# EAGLE design Nikon_PowerBoardV2 (EAGLE 7.3.0)
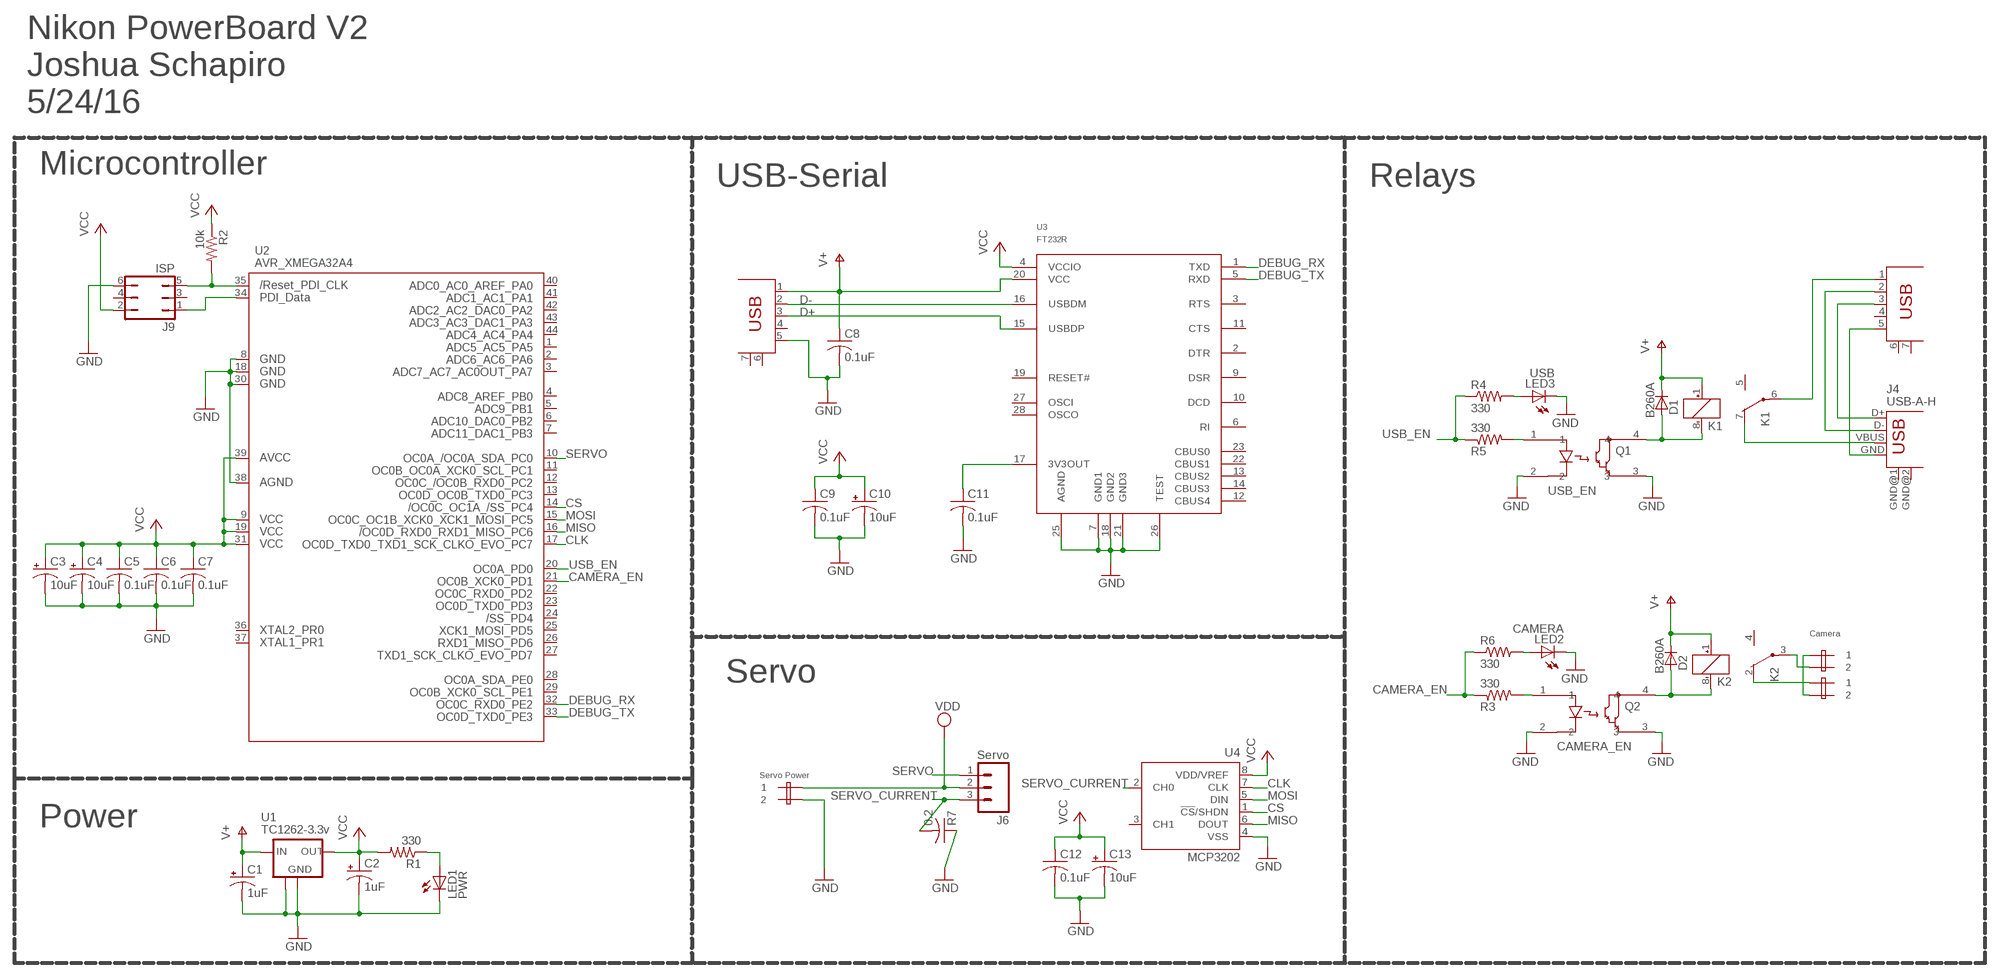
[diagram p0: schematic, sheet 1]

## Parts
C1  1uF  CAP_POL1206  [EIA3216]
C2  1uF  CAP_POL1206  [EIA3216]
C3  10uF  CAP_POL1206  [EIA3216]
C4  10uF  CAP_POL1206  [EIA3216]
C5  0.1uF  C-USC0603  [C0603]
C6  0.1uF  C-USC0603  [C0603]
C7  0.1uF  C-USC0603  [C0603]
C8  0.1uF  C-USC0603  [C0603]
C9  0.1uF  C-USC0603  [C0603]
C10  10uF  CAP_POL1206  [EIA3216]
C11  0.1uF  C-USC0603  [C0603]
C12  0.1uF  C-USC0603  [C0603]
C13  10uF  CAP_POL1206  [EIA3216]
D1  B260A  DIODESMA  [SMA-DIODE]
D2  B260A  DIODESMA  [SMA-DIODE]
J1  Camera  2-PIN_SCREWTERMINAL  [2-PIN_SCREWTERM]
J2  Camera  2-PIN_SCREWTERMINAL  [2-PIN_SCREWTERM]
J4  USB-A-H  [USB-A-H]
J5  SERVO  2-PIN_SCREWTERMINAL  [2-PIN_SCREWTERM]
J6  Servo  M03LONGPADS  [1X03_LONGPADS]
J7  MICRO-USB  MICRO-USBTO_SUPPORT  [MICRO_USB_SM_W/_TO_PINS]
J8  MICRO-USB  MICRO-USBTO_SUPPORT  [MICRO_USB_SM_W/_TO_PINS]
J9  ISP  JP3Q  [JP3Q]
K1  USB_EN  G6K-2F  [G6K-2F]
K2  CAMERA_EN  G6K-2F  [G6K-2F]
LED1  PWR  LEDCHIPLED_0603  [CHIPLED_0603]
LED2  CAMERA  LEDCHIPLED_0603  [CHIPLED_0603]
LED3  USB  LEDCHIPLED_0603  [CHIPLED_0603]
Q1  USB_EN  OPTOISOLATOR_SINGLE  [4-PIN_MINI-FLAT]
Q2  CAMERA_EN  OPTOISOLATOR_SINGLE  [4-PIN_MINI-FLAT]
R1  330  R-US_R0603  [R0603]
R2  10k  R-US_R0603  [R0603]
R3  330  R-US_R0603  [R0603]
R4  330  R-US_R0603  [R0603]
R5  330  R-US_R0603  [R0603]
R6  330  R-US_R0603  [R0603]
R7  0.2  C-USC1206  [C1206]
U1  TC1262-3.3v  REGULATOR  [SOT223]
U2  AVR_XMEGA32A4  AVR_XMEGA_A4_44A  [TQFP44]
U3  FT232R  [SSOP28]
U4  MCP3202  MCP3202SN  [SO-08]

## Nets
CAMERA_EN: R3.1 R6.1 U2.21(PD1)
CLK: U2.17(PC7) U4.7(CLK)
CS: U2.14(PC4) U4.1(!CS!/SHDN)
D+: J8.3(D+) U3.15(USBDP)
D-: J8.2(D-) U3.16(USBDM)
DEBUG_RX: U2.32(PE2) U3.1(TXD)
DEBUG_TX: U2.33(PE3) U3.5(RXD)
GND: C1.C(-) C2.C(-) C3.C(-) C4.C(-) C5.2 C6.2 C7.2 C8.2 C9.2 C10.C(-) C11.2 C12.2 C13.C(-) J5.P$2 J8.5(GND) J9.6 LED1.C LED2.C LED3.C Q1.2 Q1.3 Q2.2 Q2.3 R7.1 U1.2(GND) U1.4(GND1) U2.8(GND1) U2.18(GND2) U2.30(GND3) U2.38(AGND) U3.7(GND1) U3.18(GND2) U3.21(GND3) U3.25(AGND) U3.26(TEST) U4.4(VSS)
MISO: U2.16(PC6) U4.6(DOUT)
MOSI: U2.15(PC5) U4.5(DIN)
N$1: J9.1 U2.34(PDI_DATA)
N$2: J4.GND J7.5(GND)
N$3: J2.P$2 K2.3(2:P)
N$4: LED1.A R1.1
N$5: Q1.1 R5.2
N$6: J9.5 R2.2 U2.35(RESET)
N$7: D2.A K2.8(1:-) Q2.4
N$8: J7.1(VBUS) K1.6(3:P)
N$9: J4.VBUS K1.7(3:O)
N$10: LED3.A R4.2
N$11: Q2.1 R3.2
N$12: J1.P$1 K2.2(2:O)
N$13: J1.P$2 J2.P$1
N$18: C11.1 U3.17(3V3OUT)
N$19: LED2.A R6.2
N$90: J4.D+ J7.3(D+)
N$100: J4.D- J7.2(D-)
N$180: D1.A K1.8(1:-) Q1.4
SERVO: J6.1 U2.10(PC0)
SERVO_CURRENT: J6.3 R7.2 U4.2(CH0)
USB_EN: R4.1 R5.1 U2.20(PD0)
V+: C1.A(+) C8.1 D1.C D2.C J8.1(VBUS) K1.1(1:+) K2.1(1:+) U1.1(IN) U3.20(VCC)
VCC: C2.A(+) C3.A(+) C4.A(+) C5.1 C6.1 C7.1 C9.1 C10.A(+) C12.1 C13.A(+) J9.2 R1.2 R2.1 U1.3(OUT) U2.9(VCC1) U2.19(VCC2) U2.31(VCC3) U2.39(AVCC) U3.4(VCCIO) U4.8(VDD/VREF)
VDD: J5.P$1 J6.2
Unconnected: J4.GND@1(GND) J4.GND@2(GND) J7.4(ID) J7.6(MTN3) J7.7(MTN4) J8.4(ID) J8.6(MTN3) J8.7(MTN4) J9.3 J9.4 K1.2(2:O) K1.3(2:P) K1.4(2:S) K1.5(3:S) K2.4(2:S) K2.5(3:S) K2.6(3:P) K2.7(3:O) U2.1(PA5) U2.2(PA6) U2.3(PA7) U2.4(PB0) U2.5(PB1) U2.6(PB2) U2.7(PB3) U2.11(PC1) U2.12(PC2) U2.13(PC3) U2.22(PD2) U2.23(PD3) U2.24(PD4) U2.25(PD5) U2.26(PD6) U2.27(PD7) U2.28(PE0) U2.29(PE1) U2.36(PR0) U2.37(PR1) U2.40(PA0) U2.41(PA1) U2.42(PA2) U2.43(PA3) U2.44(PA4) U3.2(DTR) U3.3(RTS) U3.6(RI) U3.9(DSR) U3.10(DCD) U3.11(CTS) U3.12(CBUS4) U3.13(CBUS2) U3.14(CBUS3) U3.19(RESET#) U3.22(CBUS1) U3.23(CBUS0) U3.27(OSCI) U3.28(OSCO) U4.3(CH1)

## Notes on the sheet
- Nikon PowerBoard V2
  Joshua Schapiro
  5/24/16
- Microcontroller
- USB-Serial | Relays
- Camera
- Servo
- Servo Power
- Power

## Library data of the parts
C1-C4 C10 C13 = SparkFun:CAP_POL: Capacitor Polarized These are standard SMD and PTH capacitors. Normally 10uF, 47uF, and 100uF in electrolytic and tantalum varieties. Always verify the external diameter of the through hole cap, it varies with capacity, voltage, and manufacturer. The EIA devices should be standard.
C5 R7 = rcl:C-US: CAPACITOR, American symbol
C6-C9 C11 C12 = resistor:C-US: CAPACITOR, American symbol
D1 D2 = SparkFun:DIODE: Diode These are standard reverse protection diodes and small signal diodes. SMA package can handle up to about 1A. SOD-323 can handle about 200mA. What the SOD-323 package when ordering, there are some mfgs out there that are 5-pin packages.
J1 J2 J5 = Josh:2-PIN_SCREWTERMINAL
J4 = GadgetOne:USB: USB Connectors
J6 = SparkFun:M03: Header 3 Standard 3-pin 0.1" header. Use with straight break away headers (SKU : PRT-00116), right angle break away headers (PRT-00553), swiss pins (PRT-00743), machine pins (PRT-00117), and female headers (PRT-00115). Molex polarized connector foot print use with SKU : PRT-08232 with associated crimp pins and housings.
J7 J8 = Josh:MICRO-USB
J9 = jumper:JP3Q: JUMPER
K1 K2 = relay:G6K: Low Signal Relay oeiwcsnts1.omron.com/.. D20G6K0100.pdf
LED1-LED3 = led:LED: LED OSRAM: - CHIPLED LG R971, LG N971, LY N971, LG Q971, LY Q971, LO R971, LY R971 LH N974, LH R974 LS Q976, LO Q976, LY Q976 LO Q996 - Hyper CHIPLED LW Q18S LB Q993, LB Q99A, LB R99A - SideLED LS A670, LO A670, LY A670, LG A670, LP A670 LB A673, LV A673, LT A673, LW A673 LH A674 LY A675 LS A676, LA A676, LO A676, LY A676, LW A676 LS A679, LY A679, LG A679 - Hyper Micro SIDELED® LS Y876, LA Y876, LO Y876, LY Y876 LT Y87S - SmartLED LW L88C, LW L88S LB L89C, LB L89S, LG L890 LS L89K, LO L89K, LY L89K LS L896, LA L896, LO L896, LY L896 - TOPLED LS T670, LO T670, LY T670, LG T670, LP T670 LSG T670, LSP T670, LSY T670, LOP T670, LYG T670 LG T671, LOG T671, LSG T671 LB T673, LV T673, LT T673, LW T673 LH T674 LS T676, LA T676, LO T676, LY T676, LB T676, LH T676, LSB T676, LW T676 LB T67C, LV T67C, LT T67C, LS T67K, LO T67K, LY T67K, LW E67C LS E67B, LA E67B, LO E67B, LY E67B, LB E67C, LV E67C, LT E67C LW T67C LS T679, LY T679, LG T679 LS T770, LO T770, LY T770, LG T770, LP T770 LB T773, LV T773, LT T773, LW T773 LH T774 LS E675, LA E675, LY E675, LS T675 LS T776, LA T776, LO T776, LY T776, LB T776 LHGB T686 LT T68C, LB T68C - Hyper Mini TOPLED® LB M676 - Mini TOPLED Santana® LG M470 LS M47K, LO M47K, LY M47K Source: http://www.osram.convergy.de LUXEON: - LUMILED® LXK2-PW12-R00, LXK2-PW12-S00, LXK2-PW14-U00, LXK2-PW14-V00 LXK2-PM12-R00, LXK2-PM12-S00, LXK2-PM14-U00 LXK2-PE12-Q00, LXK2-PE12-R00, LXK2-PE12-S00, LXK2-PE14-T00, LXK2-PE14-U00 LXK2-PB12-K00, LXK2-PB12-L00, LXK2-PB12-M00, LXK2-PB14-N00, LXK2-PB14-P00, LXK2-PB14-Q00 LXK2-PR12-L00, LXK2-PR12-M00, LXK2-PR14-Q00, LXK2-PR14-R00 LXK2-PD12-Q00, LXK2-PD12-R00, LXK2-PD12-S00 LXK2-PH12-R00, LXK2-PH12-S00 LXK2-PL12-P00, LXK2-PL12-Q00, LXK2-PL12-R00 Source: www.luxeon.com KINGBRIGHT: KA-3528ASYC Source: www.kingbright.com
Q1 Q2 = Josh:OPTOISOLATOR_SINGLE: Digikey: 425-2098-1-ND If = 10ma Ic = 80ma
R1-R6 = resistor:R-US_: RESISTOR, American symbol
U1 = GadgetOne:REGULATOR: VOLTAGE REGULATOR, see: http://focus.ti.com/lit/ds/symlink/ua78m05.pdf
U2 = xmega:AVR_XMEGA_A4_: Device for Atmel AVR XMEGA A4 Series
U3 = gadgetry:FT232R
U4 = microchip:MCP3202: 2.7V Dual Channel 12-Bit A/D Converter with SPI Serial Interface Source: http://ww1.microchip.com/downloads/en/DeviceDoc/21034D.pdf

## Net classes
4 xxwide: width 0.203 mm

## Board
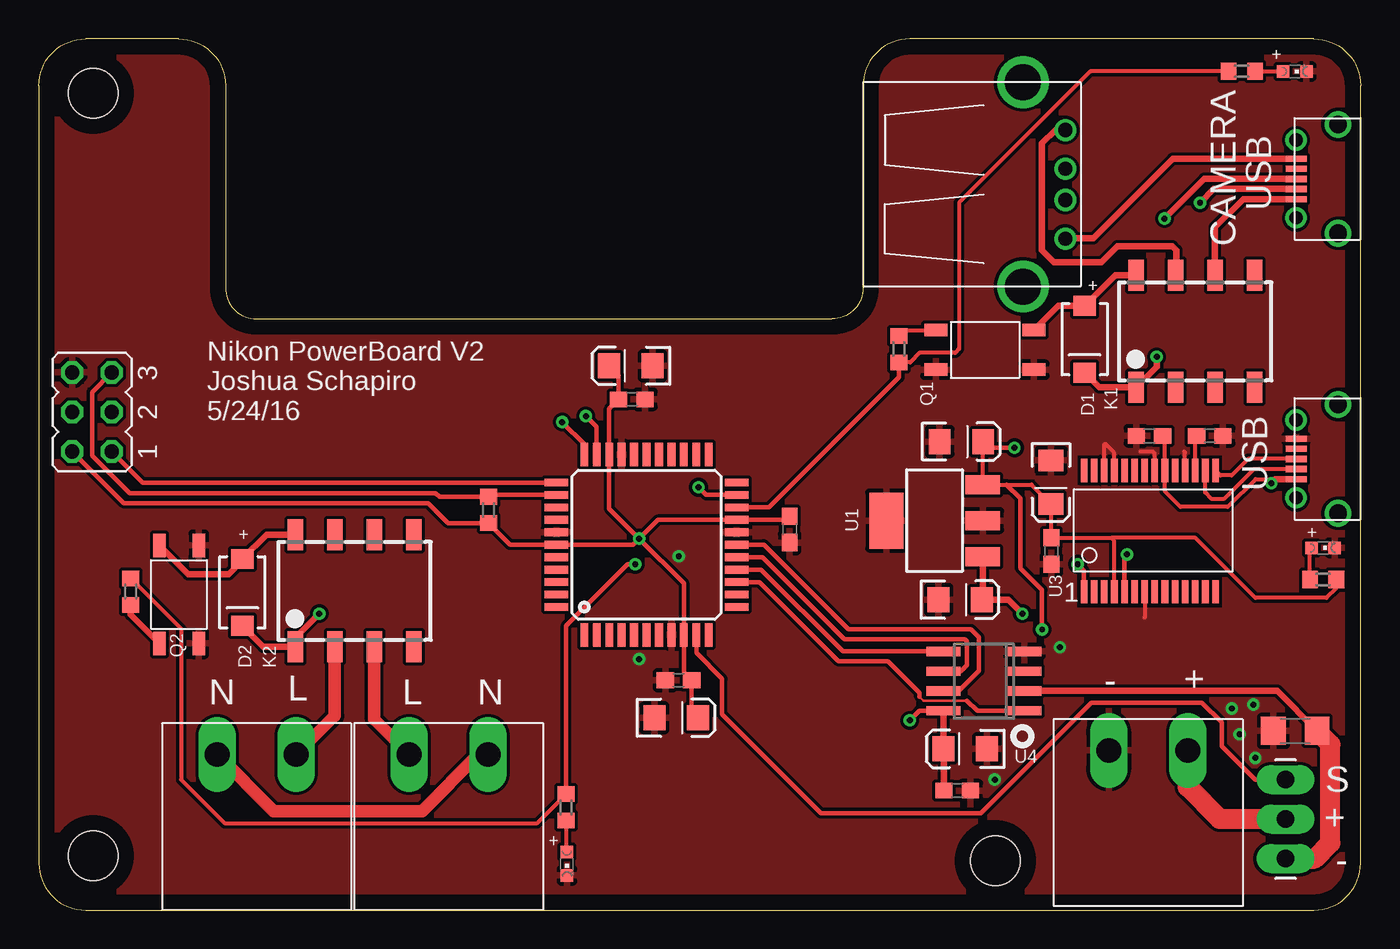
[diagram p1: board, top side]
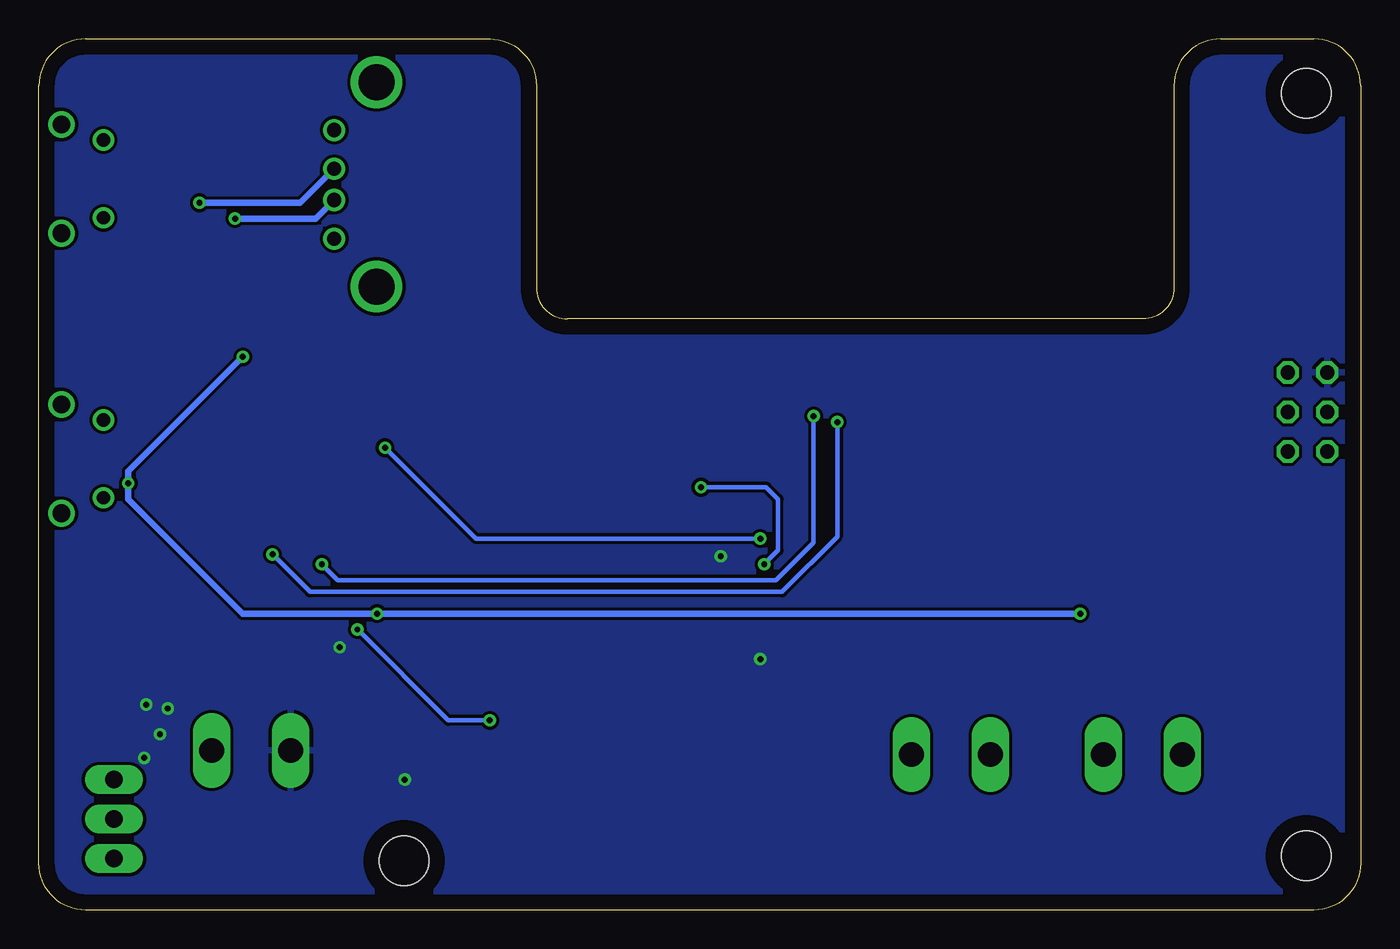
[diagram p2: board, bottom side, seen from below]

Size 85 x 56 mm. Coordinates in mm from the lower left corner, seen from the top.
Outline: 3,0 82,0 arc90 85,3 85,53 arc90 82,56 56,56 arc90 53,53 53,40 arc-90 51,38 14,38 arc-90 12,40 12,53 arc90 9,56 3,56 arc90 0,53 0,3 arc90 3,0
Copper layers (1*16): Top 0.035mm / dielectric 1.5mm / Bottom 0.035mm
Design rules "default *": minimum track width 6mil, minimum drill 15mil, track to track 8mil, track to pad 8mil, pad to pad 8mil, via to via 8mil, smd to smd 8mil, copper to edge 40mil, drill to drill 8mil, minimum pad ring 10mil, minimum via ring 8mil, stop-mask expansion 4mil, vias tented up to drill 0mil, thermal gap 10mil
Holes 3.17 mm at 3.5,52.5 61.5,3.17 3.5,3.5
tRestrict: area 66.8,19.5 to 76.1,21.4; area 66.8,27.3 to 76.1,29.2

### Footprints (pad centres in the part's own frame; a part is rotated, then mirrored left to right if it is on the bottom)
EIA3216 = smd 1.4 x 1.6: A 1.4,0; C -1.4,0
C0603 = smd 1.1 x 1: 1 -0.85,0; 2 0.85,0
SMA-DIODE = smd 1.27 x 1.47: A -2.15,0; C 2.15,0
2-PIN_SCREWTERM = drill 1.6 long: P$1 -2.54,0; P$2 2.54,0
USB-A-H = drill 0.914: D+ 2.718,-1.003; D- 2.718,1.003; GND 2.718,-3.493; VBUS 2.718,3.493 | drill 2.311: GND@1 0,6.566; GND@2 0,-6.566
1X03_LONGPADS = drill 1.118 pad 1.88 long: 1 0,0; 2 2.54,0; 3 5.08,0
MICRO_USB_SM_W/_TO_PINS = smd 0.4 x 1.35: 1 -1.3,4.15; 2 -0.65,4.15; 3 0,4.15; 4 0.65,4.15; 5 1.3,4.15 | drill 1.15: 6 -3.5,1.45; 7 3.5,1.45 | drill 0.85: P$1 -2.5,4.15; P$2 2.5,4.15
JP3Q = drill 0.914 octagon: 1 -2.54,-1.27; 2 -2.54,1.27; 3 0,-1.27; 4 0,1.27; 5 2.54,-1.27; 6 2.54,1.27
G6K-2F = smd 1 x 2: 1 -3.81,-3.6; 2 -1.27,-3.6; 3 1.27,-3.6; 4 3.81,-3.6; 5 3.81,3.6; 6 1.27,3.6; 7 -1.27,3.6; 8 -3.81,3.6
CHIPLED_0603 = smd 0.8 x 0.8: A 0,-0.75; C 0,0.75
4-PIN_MINI-FLAT = smd 1.5 x 0.8: 1 -3.15,1.27; 2 -3.15,-1.27; 3 3.15,-1.27; 4 3.15,1.27
R0603 = smd 1 x 1.1: 1 -0.85,0; 2 0.85,0
C1206 = smd 1.6 x 1.8: 1 -1.4,0; 2 1.4,0
SOT223 = smd 1.219 x 2.235: 1 -2.311,-3.099; 2 0,-3.099; 3 2.311,-3.099 | smd 3.6 x 2.2: 4 0,3.099
TQFP44 = smd 1.5 x 0.5: 1 -5.8,4; 2 -5.8,3.2; 3 -5.8,2.4; 4 -5.8,1.6; 5 -5.8,0.8; 6 -5.8,0; 7 -5.8,-0.8; 8 -5.8,-1.6; 9 -5.8,-2.4; 10 -5.8,-3.2; 11 -5.8,-4; 23 5.8,-4; 24 5.8,-3.2; 25 5.8,-2.4; 26 5.8,-1.6; 27 5.8,-0.8; 28 5.8,0; 29 5.8,0.8; 30 5.8,1.6; 31 5.8,2.4; 32 5.8,3.2; 33 5.8,4 | smd 0.5 x 1.5: 12 -4,-5.8; 13 -3.2,-5.8; 14 -2.4,-5.8; 15 -1.6,-5.8; 16 -0.8,-5.8; 17 0,-5.8; 18 0.8,-5.8; 19 1.6,-5.8; 20 2.4,-5.8; 21 3.2,-5.8; 22 4,-5.8; 34 4,5.8; 35 3.2,5.8; 36 2.4,5.8; 37 1.6,5.8; 38 0.8,5.8; 39 0,5.8; 40 -0.8,5.8; 41 -1.6,5.8; 42 -2.4,5.8; 43 -3.2,5.8; 44 -4,5.8
SSOP28 = smd 0.425 x 1.5: 1 0.65,-1.3; 2 1.3,-1.3; 3 1.95,-1.3; 4 2.6,-1.3; 5 3.25,-1.3; 6 3.9,-1.3; 7 4.55,-1.3; 8 5.2,-1.3; 9 5.85,-1.3; 10 6.5,-1.3; 11 7.15,-1.3; 12 7.8,-1.3; 13 8.45,-1.3; 14 9.1,-1.3; 15 9.1,6.5; 16 8.45,6.5; 17 7.8,6.5; 18 7.15,6.5; 19 6.5,6.5; 20 5.85,6.5; 21 5.2,6.5; 22 4.55,6.5; 23 3.9,6.5; 24 3.25,6.5; 25 2.6,6.5; 26 1.95,6.5; 27 1.3,6.5; 28 0.65,6.5
SO-08 = smd 0.6 x 2.2: 1 -1.905,-2.6; 2 -0.635,-2.6; 3 0.635,-2.6; 4 1.905,-2.6; 5 1.905,2.6; 6 0.635,2.6; 7 -0.635,2.6; 8 -1.905,2.6

### Placement (x,y rotation side)
C1  59.25,19.95 0 top
C2  59.33,30.11 0 top
C3  40.98,12.36 0 top
C4  38.06,34.99 180 top
C5  48.27,24.47 270 top
C6  38.14,32.83 0 top
C7  41.14,14.77 180 top
C8  71.42,30.48 180 top
C9  65.11,23.07 270 top
C10  65.09,27.5 270 top
C11  75.3,30.48 0 top
C12  59.05,7.68 0 top
C13  59.56,10.36 180 top
D1  67.25,36.69 270 top
D2  13.09,20.42 270 top
J1  14,10 180 top
J2  26.35,10 180 top
J4  63.29,46.65 0 top
J5  71.34,10.25 180 top
J6  80.17,8.39 270 top
J7  85,47 90 top
J8  85,29 90 top
J9  3.42,32.01 90 top
K1  74.37,37.2 0 top
K2  20.3,20.52 0 top
LED1  82.58,23.28 270 top
LED2  33.96,2.97 180 top
LED3  80.76,53.9 270 top
Q1  60.84,36.01 0 top
Q2  9.01,20.29 90 top
R1  82.58,21.25 0 top
R2  28.92,25.71 90 top
R3  5.91,20.46 270 top
R4  77.35,53.92 0 top
R5  55.32,36.06 90 top
R6  33.91,6.6 270 top
R7  80.79,11.52 0 top
U1  57.6,25.03 90 top
U2  39.08,23.48 90 top
U3  66.56,21.76 0 top
U4  60.77,14.71 90 top

### Tracks (layer width: path | path; a pad name or v marks a point on that pad's centre or on a via)
CAMERA_EN  (via drill 0.38)
  Top 0.254: R3.1 9.14,18.08 9.14,8.38 11.94,5.59 32.04,5.59 R6.1
  Top 0.305: R6.1 33.91,18.28 37.85,22.23 v38.35,22.23 | v42.42,27.18 42.91,26.68 U2.21
  Bottom 0.305: v38.35,22.23 37.47,23.11 37.47,26.42 38.23,27.18 v42.42,27.18
CLK
  Top 0.305: U2.17 46.62,23.48 52.07,18.03 59.94,18.03 60.45,17.53 60.45,15.37 59.16,14.08 U4.7
CS
  Top 0.152: 59.69,13.46 56.9,13.46 56.64,13.72
  Top 0.305: U4.1 60.34,12.81 59.69,13.46 | 56.64,13.72 56.64,13.97 54.61,16 51.44,16 46.36,21.08 U2.14
D+
  Top 0.254: J8.3 77.77,29 76.71,27.94 75.98,27.94 U3.15
D-
  Top 0.254: J8.2 78.13,28.35 76.2,26.42 75.44,26.42 75.01,26.84 U3.16
DEBUG_RX  (via drill 0.38)
  Top 0.305: U2.32 35.88,31.05 v35.18,31.75 | v66.8,22.23 67.21,21.82 U3.1
  Bottom 0.305: v35.18,31.75 35.18,23.62 37.59,21.21 65.79,21.21 v66.8,22.23
DEBUG_TX  (via drill 0.38)
  Top 0.305: U2.33 35.08,29.95 v33.66,31.37 | v69.98,22.86 69.81,22.69 U3.5
  Bottom 0.305: v33.66,31.37 33.66,24 37.21,20.45 67.56,20.45 v69.98,22.86
GND  (via drill 0.38)
  Top 0.254: U3.21 71.76,29.33 71.63,29.46 70.87,29.46 | U3.18 73.71,29.41 73.66,29.46 | U3.26 68.51,29.9 68.58,29.97 69.16,29.39 U3.25 | U3.7 71.11,18.81 71.12,18.8
  other vias: 61.47,8.38 65.66,16.89 76.71,12.95 78.11,13.21 77.22,11.3 78.23,9.78 38.61,16.13 41.15,22.73
  pour Bottom: 0,0 85,0 85,56 0,56
  pour Top: 0,56 85,56 85,0 0,0
MISO
  Top 0.305: U4.6 59.29,15.35 59.69,15.75 59.69,17.27 59.56,17.4 51.82,17.4 46.53,22.68 U2.16
MOSI
  Top 0.305: U4.5 51.71,16.62 46.45,21.88 U2.15
N$1
  Top 0.305: U2.34 6.68,27.48 J9.1
N$2
  Top 0.406: J7.5 72.94,48.3 67.82,43.18 66.03,43.18 J4.GND
N$3
  Top 0.813: J2.P$2 21.57,12.25 K2.3
N$4
  Top 0.254: R1.1 81.73,23.18 LED1.A
N$5
  Top 0.254: R5.2 55.69,37.28 Q1.1
N$6
  Top 0.305: J9.5 3.43,33.29 3.43,29.21 5.84,26.8 25.53,26.8 25.76,26.56 R2.2 29.03,26.68 U2.35
N$7
  Top 0.406: K2.8 14.63,24.12 D2.A 13.09,22.48 12.19,21.59 9.59,21.59 Q2.4
N$8
  Top 0.406: J7.1 77.45,45.7 75.64,43.89 K1.6
N$9
  Top 0.406: K1.7 73.15,40.86 73.15,42.42 72.9,42.67 69.34,42.67 68.33,41.66 65.28,41.66 64.52,42.42 64.52,49.28 65.38,50.14 J4.VBUS
N$10
  Top 0.254: R4.2 80,53.92 LED3.A
N$11
  Top 0.406: Q2.1 5.91,18.97 R3.2
N$12
  Top 0.813: J1.P$1 19.03,12.49 K2.2
N$13
  Top 0.813: J1.P$2 15.11,6.35 24.64,6.35 28.29,10 J2.P$1
N$18
  Top 0.254: U3.17 74.36,30.06 C11.1
N$19
  Top 0.254: R6.2 33.91,3.78 LED2.A
N$90  (via drill 0.38)
  Top 0.406: J7.3 74.94,47 v72.39,44.45
  Bottom 0.406: v72.39,44.45 67.2,44.45 J4.D+
N$100  (via drill 0.38)
  Top 0.406: J7.2 75.56,46.35 v74.68,45.47
  Bottom 0.406: v74.68,45.47 68.19,45.47 J4.D-
N$180
  Top 0.406: Q1.4 65.55,38.84 D1.A 69.21,40.8 K1.8
SERVO
  Top 0.305: J6.1 78.23,8.38 76.07,10.54 76.07,12.06 74.8,13.34 67.69,13.34 60.58,6.22 50.29,6.22 43.94,12.57 43.94,14.86 42.28,16.52 U2.10
SERVO_CURRENT
  Top 0.406: R7.2 79.63,14.08 U4.2
  Top 1.27: J6.3 82.05,3.31 83.06,4.32 83.06,10.65 R7.2
USB_EN
  Top 0.254: R4.1 67.64,53.92 59.18,45.47 59.18,36.07 58.93,35.81 56.64,35.81 56.04,35.21 R5.1
  Top 0.305: U2.20 46.96,25.88 55.32,34.23 R5.1
V+  (via drill 0.38)
  Top 0.254: C8.1 72.41,30.34 U3.20 72.41,26.91 73.41,25.91 76.45,25.91 78.25,27.7 J8.1
  Top 0.406: D2.C 14.44,16.92 K2.1 16.49,17.5 v18.03,19.05 | D1.C 68.2,33.6 K1.1 71.88,34.93 v71.88,35.56 | J8.1 79.52,27.7 v79.25,27.43 | U1.1 60.7,20 C1.A 62.34,19.95 v63.25,19.05
  Bottom 0.406: v71.88,35.56 79.25,28.19 v79.25,27.43 79.25,26.42 71.88,19.05 64.52,19.05 v63.25,19.05 v18.03,19.05
VCC  (via drill 0.38)
  Top 0.254: 68.96,23.92 C9.1 65.11,26.07 C10.A 63.84,27.34 62.23,27.34 U1.3 60.7,30.09 C2.A | R1.2 83.43,20.7 82.8,20.07 78.23,20.07 74.38,23.92 68.96,23.92 | U3.4 69.16,23.72 68.96,23.92
  Top 0.305: C3.A 41.99,12.75 C7.1 41.48,15.28 U2.9 41.48,21.01 v38.61,23.88 | C5.1 48.03,25.08 U2.19 39.81,25.08 v38.61,23.88 | C4.A 37.29,34.36 C6.1 36.68,32.22 U2.31 36.68,25.81 v38.61,23.88 | v38.61,23.88 38.21,23.48 U2.39 30.3,23.48 R2.1 26.32,24.86 25.02,26.16 5.46,26.16 J9.2 | v62.74,29.72 61.12,29.72 C2.A | U4.8 56.62,12.81 v56.01,12.19 | v64.52,18.03 64.52,20.57 63.12,21.97 63.12,26.45 62.23,27.34
  Top 0.406: C12.1 58.2,10.32 C13.A 58.17,10.37 U4.8
  Bottom 0.305: v38.61,23.88 56.9,23.88 v62.74,29.72 | v56.01,12.19 58.67,12.19 v64.52,18.03
VDD
  Top 1.27: J6.2 75.94,5.84 73.88,7.91 J5.P$1

### Text on the board
tPlace: - | + | S | + | -
tNames: + | USB | CAMERA | + | Nikon PowerBoard V2 / Joshua Schapiro / 5/24/16 | USB | + | + | N | L | L | N | +